# EAGLE schematic wuBaseV1.4PH (EAGLE 9.6.2)
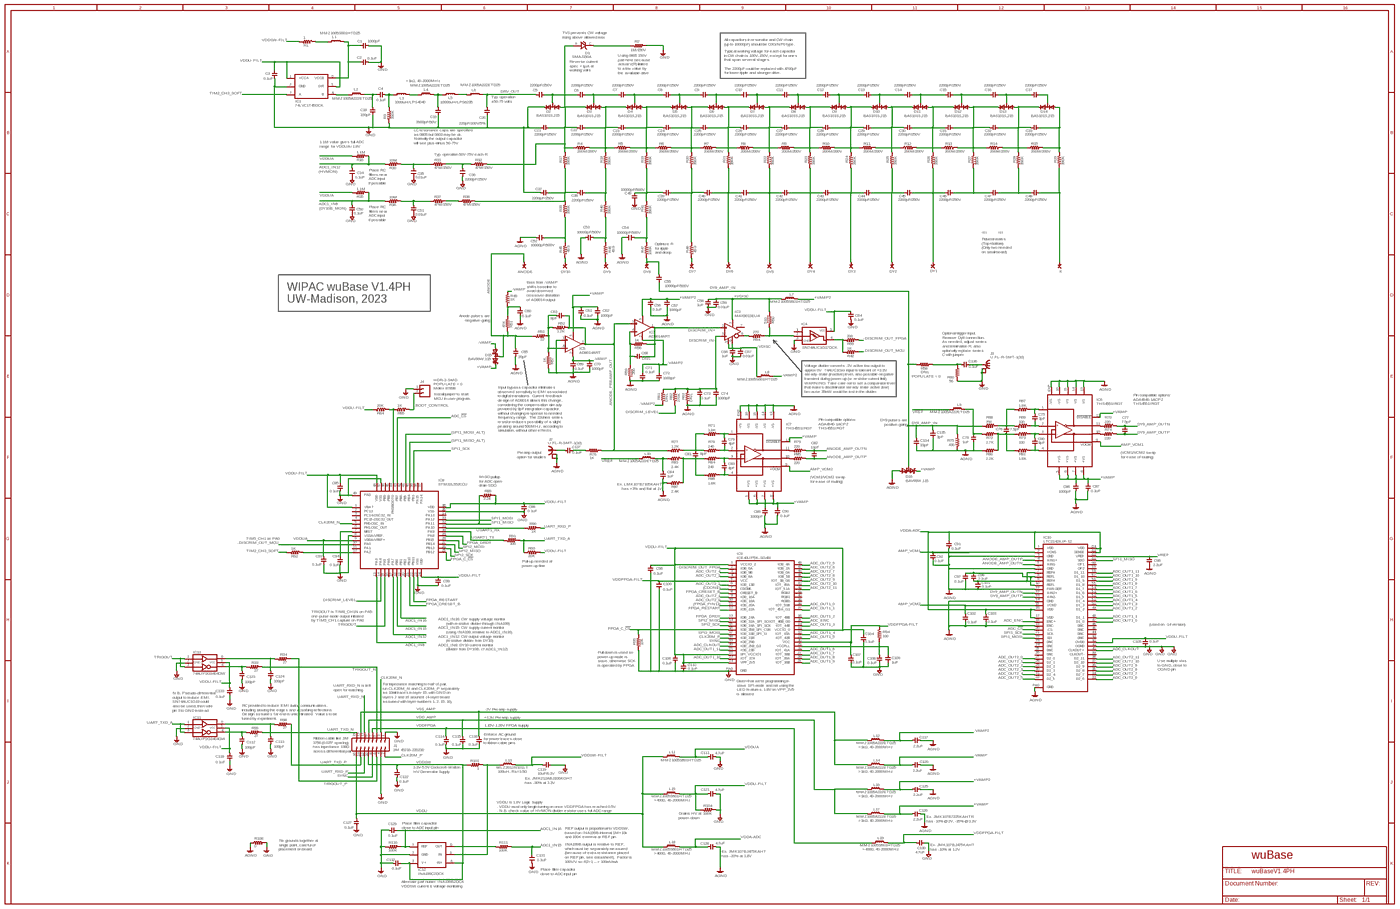
[diagram p0: schematic, sheet 1, overview]
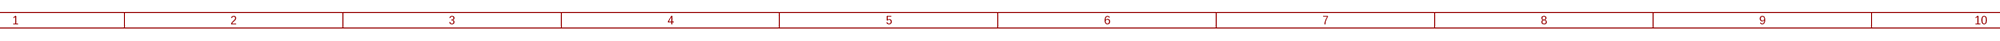
[diagram p1: schematic, sheet 1, part 1 of 4]
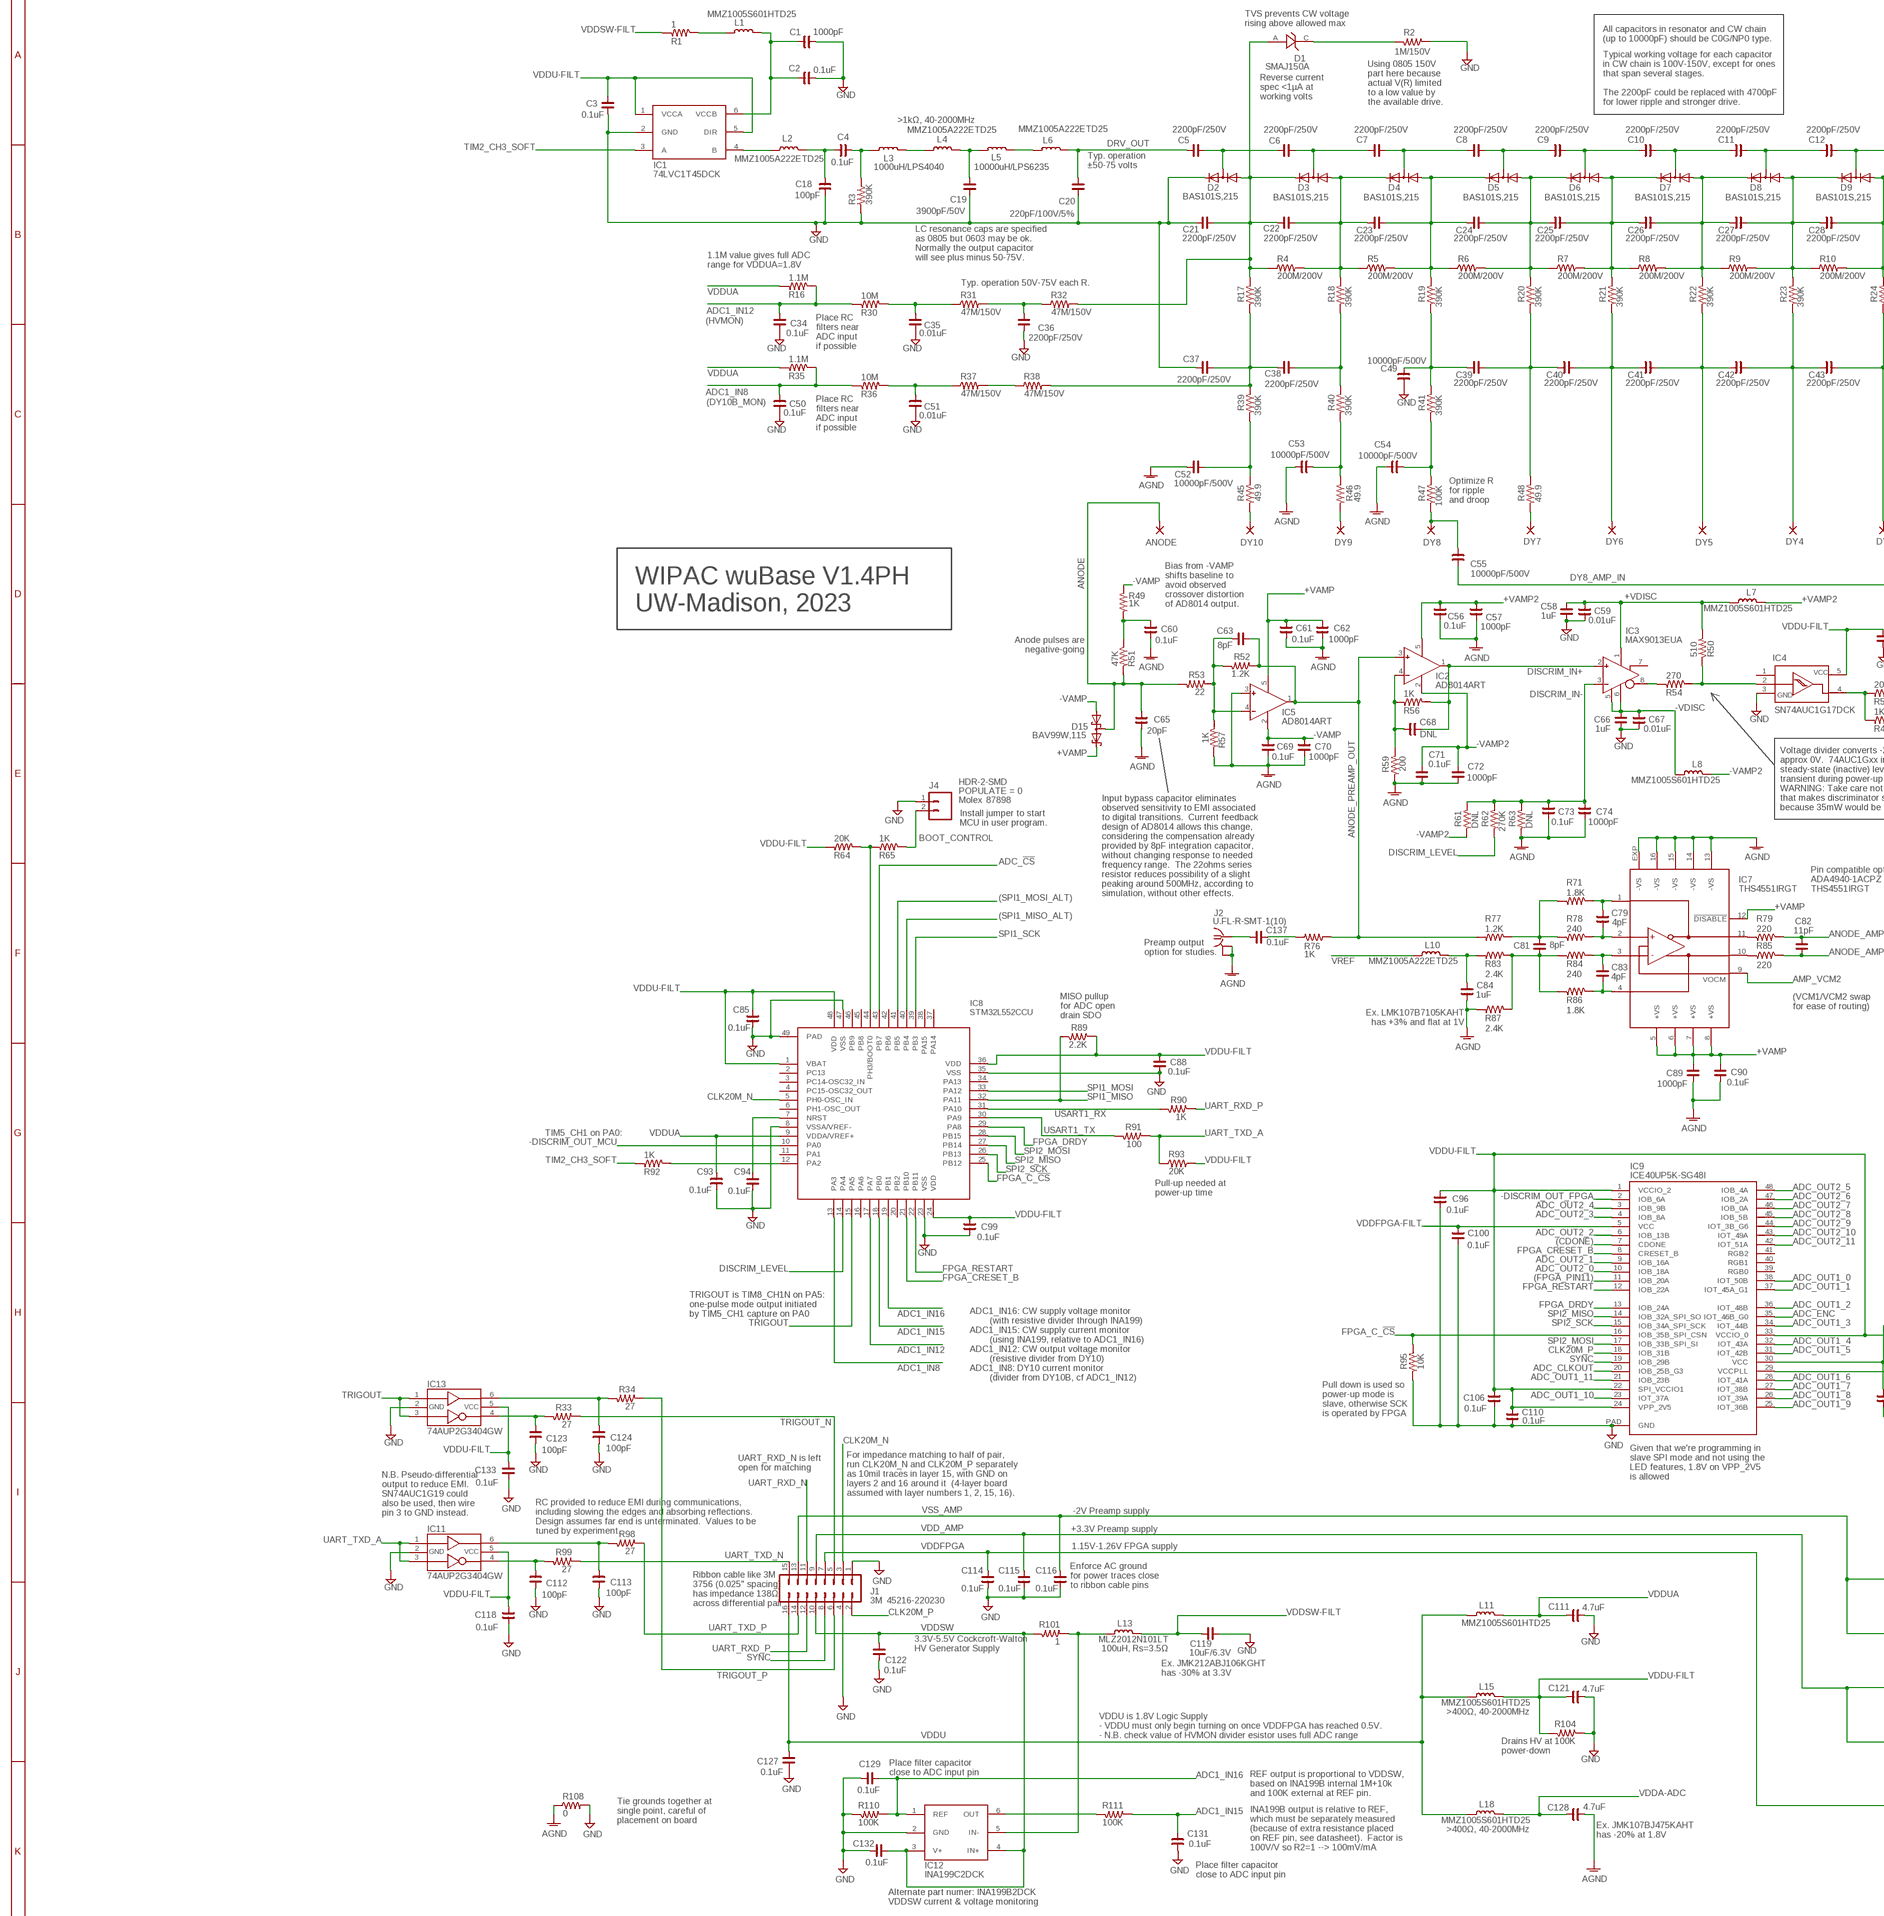
[diagram p2: schematic, sheet 1, part 2 of 4]
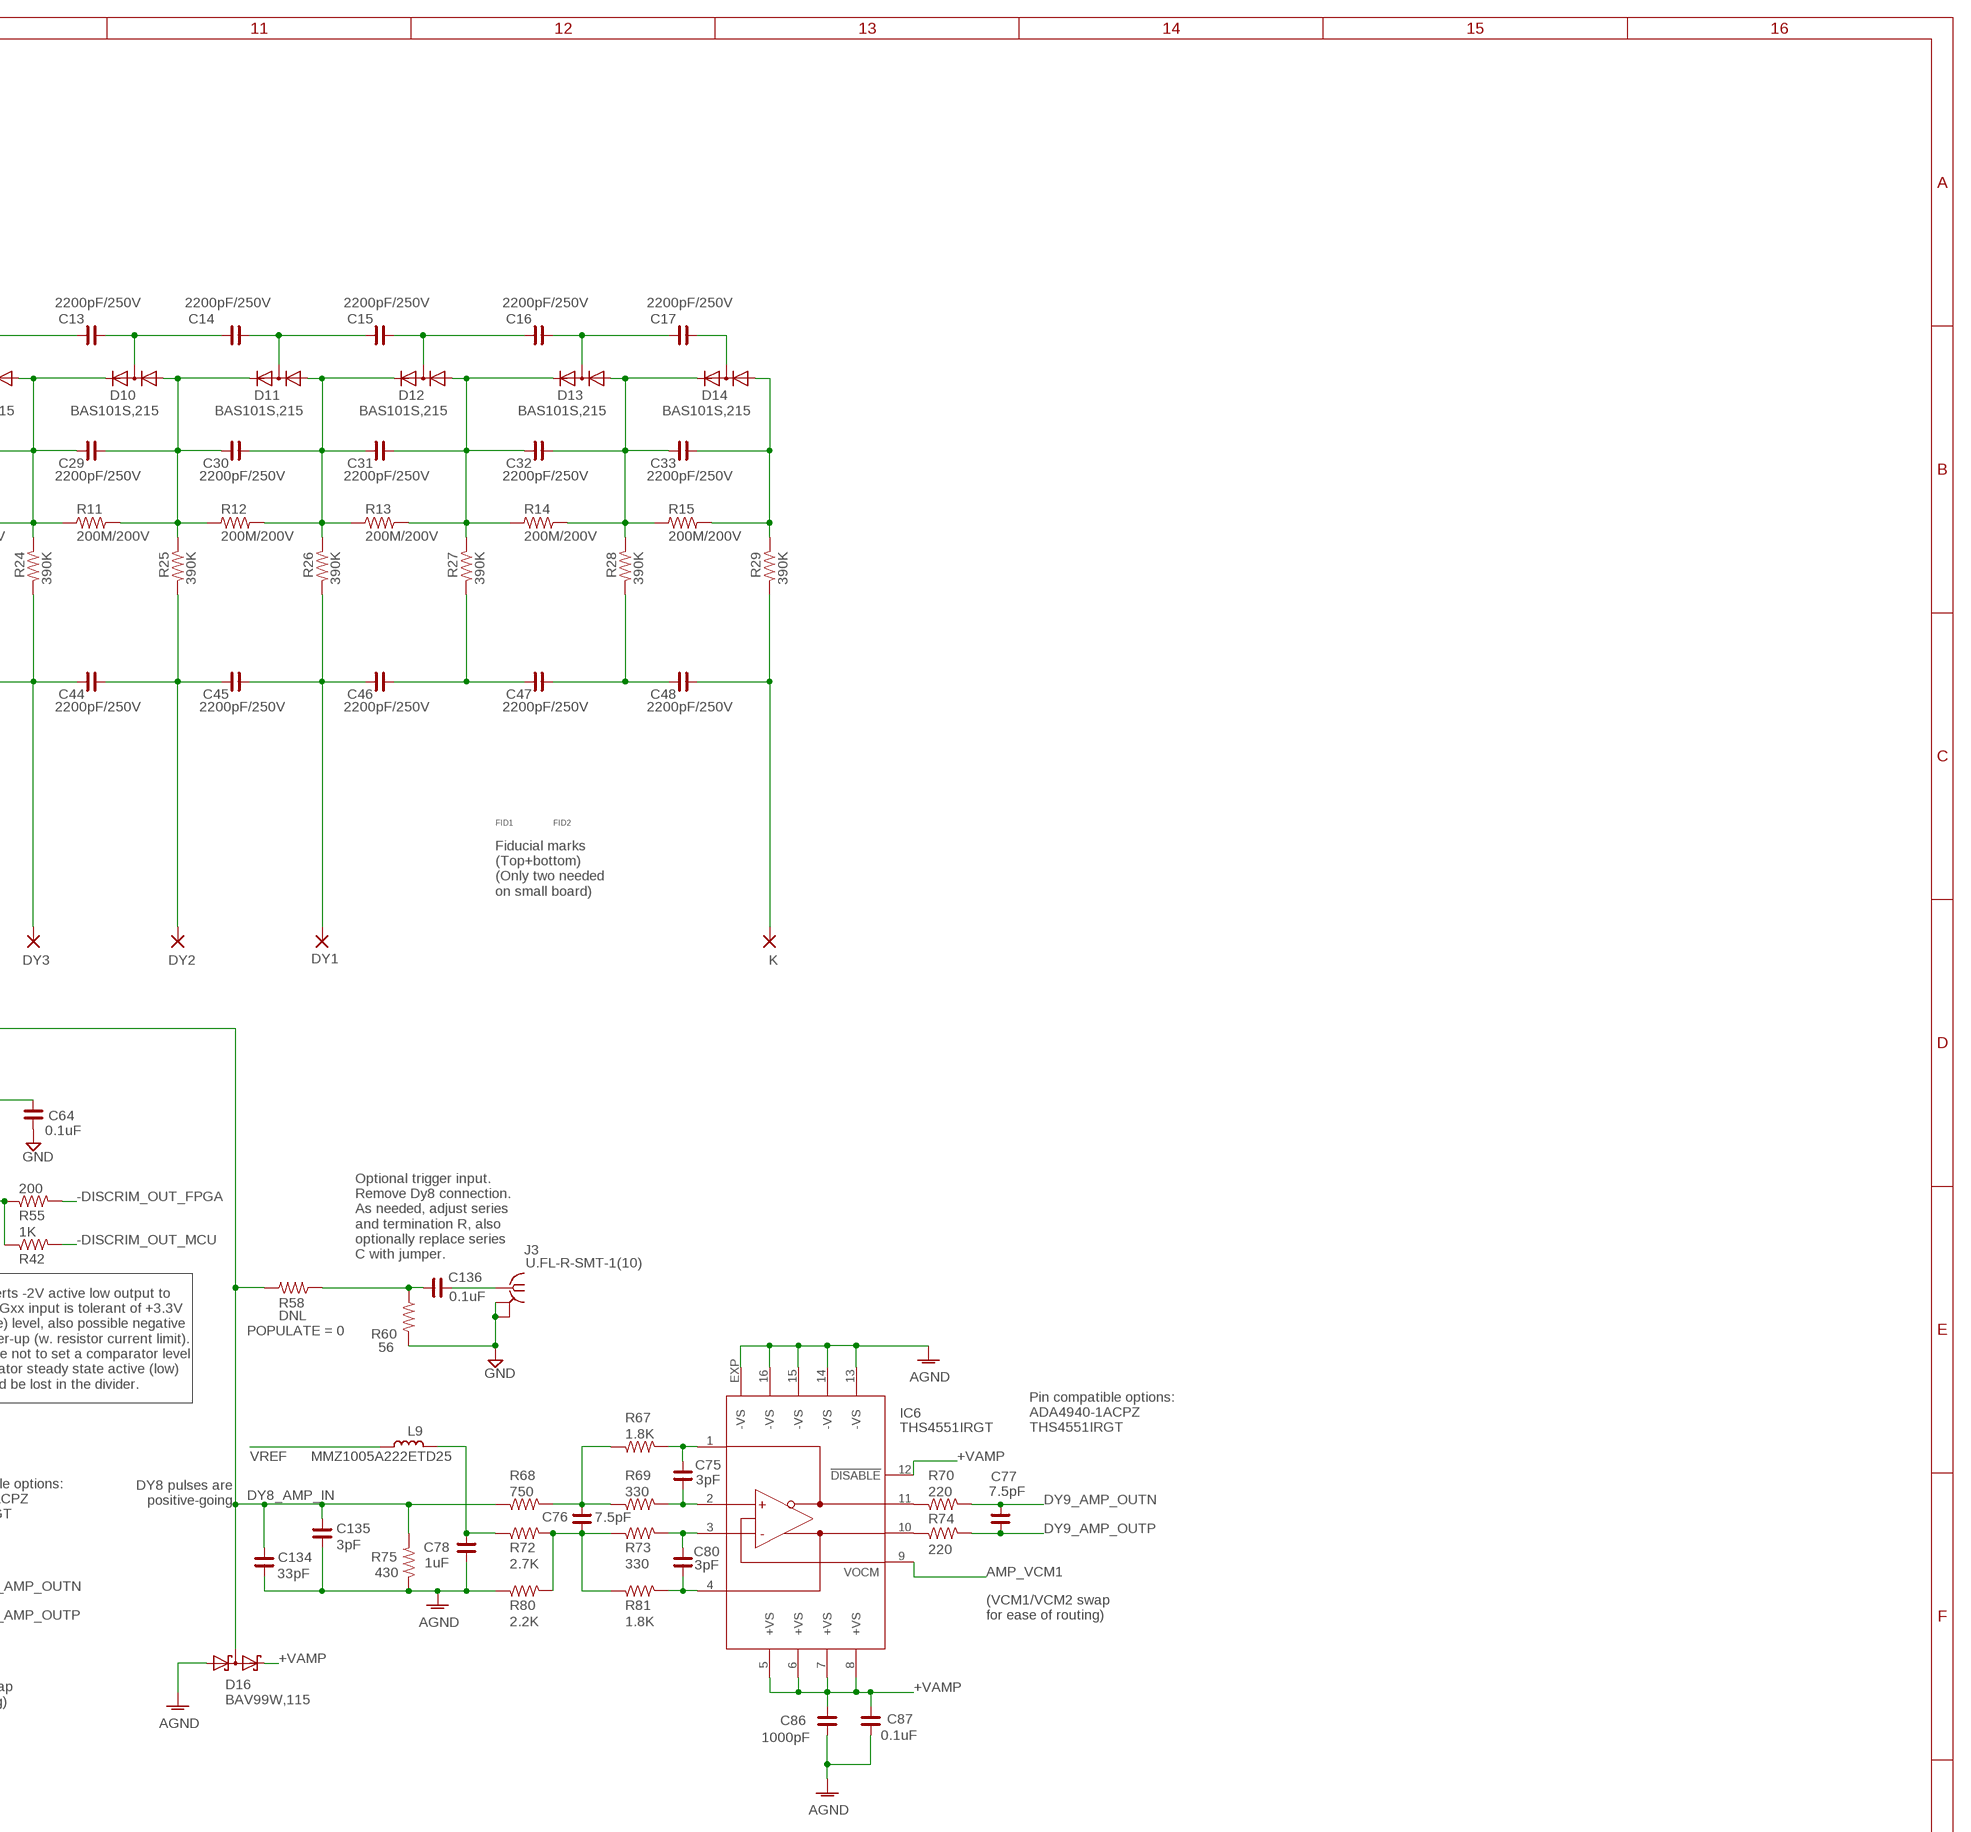
[diagram p3: schematic, sheet 1, part 3 of 4]
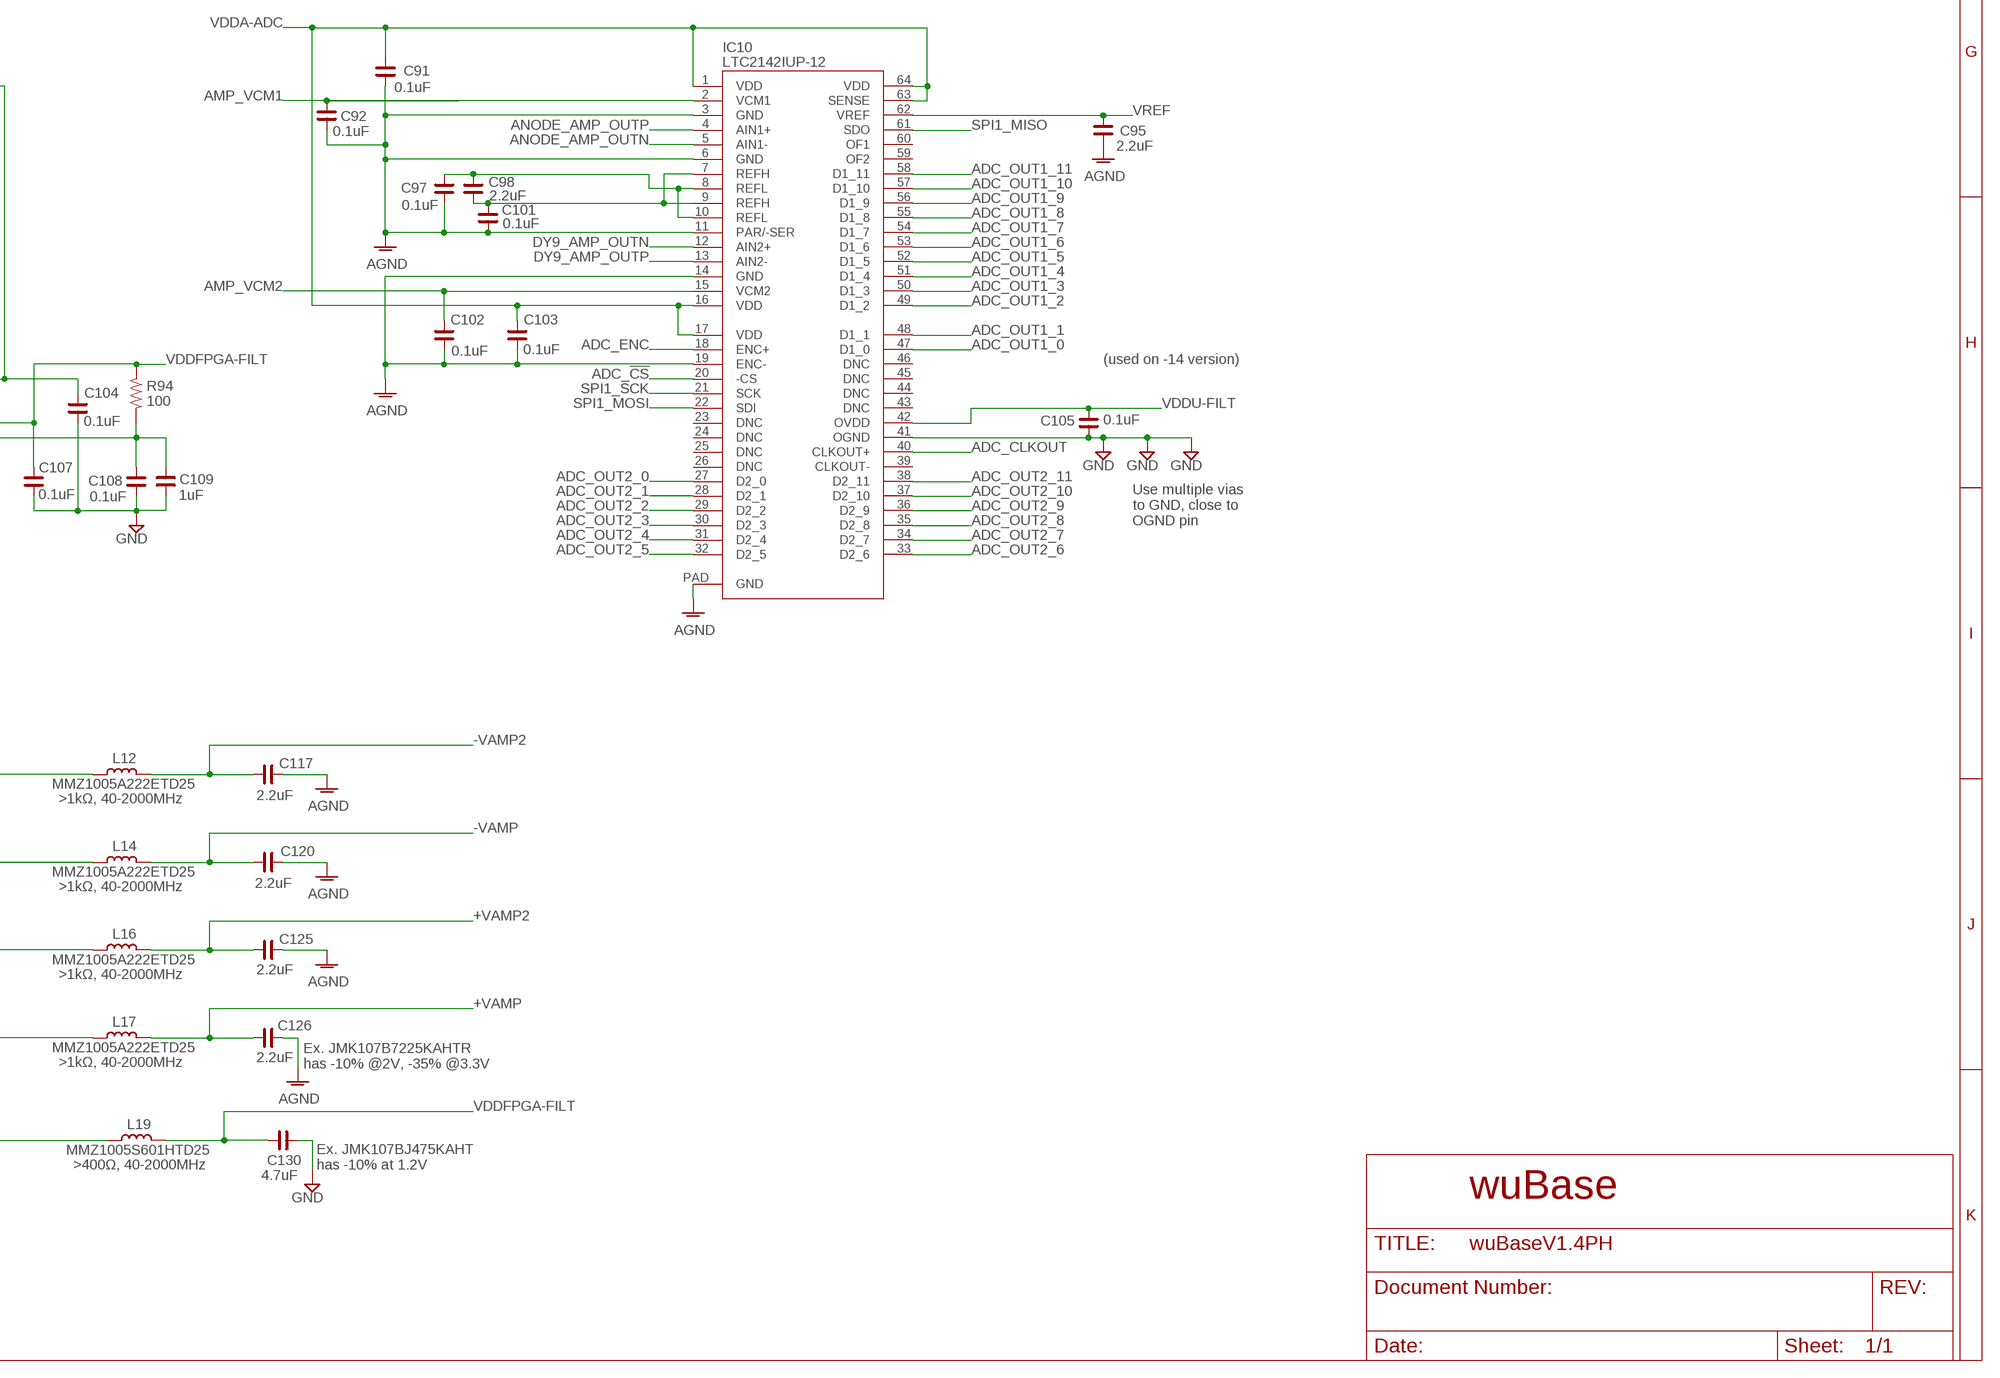
[diagram p4: schematic, sheet 1, part 4 of 4]

## Parts
ANODE  PAD-0430-BARE  [0430-BARE]
C1  1000pF  C_0402  [C0402]
C2  0.1uF  C_0402  [C0402]
C3  0.1uF  C_0402  [C0402]
C4  0.1uF  C_0402HV  [C0402-HV]
C5  2200pF/250V  C_0805HV  [C0805-HV]
C6  2200pF/250V  C_0805HV  [C0805-HV]
C7  2200pF/250V  C_0805HV  [C0805-HV]
C8  2200pF/250V  C_0805HV  [C0805-HV]
C9  2200pF/250V  C_0805HV  [C0805-HV]
C10  2200pF/250V  C_0805HV  [C0805-HV]
C11  2200pF/250V  C_0805HV  [C0805-HV]
C12  2200pF/250V  C_0805HV  [C0805-HV]
C13  2200pF/250V  C_0805HV  [C0805-HV]
C14  2200pF/250V  C_0805HV  [C0805-HV]
C15  2200pF/250V  C_0805HV  [C0805-HV]
C16  2200pF/250V  C_0805HV  [C0805-HV]
C17  2200pF/250V  C_0805HV  [C0805-HV]
C18  100pF  C_0402HV  [C0402-HV]
C19  3900pF/50V  C_0805HV  [C0805-HV]
C20  220pF/100V/5%  C_0805HV  [C0805-HV]
C21  2200pF/250V  C_0805HV  [C0805-HV]
C22  2200pF/250V  C_0805HV  [C0805-HV]
C23  2200pF/250V  C_0805HV  [C0805-HV]
C24  2200pF/250V  C_0805HV  [C0805-HV]
C25  2200pF/250V  C_0805HV  [C0805-HV]
C26  2200pF/250V  C_0805HV  [C0805-HV]
C27  2200pF/250V  C_0805HV  [C0805-HV]
C28  2200pF/250V  C_0805HV  [C0805-HV]
C29  2200pF/250V  C_0805HV  [C0805-HV]
C30  2200pF/250V  C_0805HV  [C0805-HV]
C31  2200pF/250V  C_0805HV  [C0805-HV]
C32  2200pF/250V  C_0805HV  [C0805-HV]
C33  2200pF/250V  C_0805HV  [C0805-HV]
C34  0.1uF  C_0402  [C0402]
C35  0.01uF  C_0402  [C0402]
C36  2200pF/250V  C_0805HV  [C0805-HV]
C37  2200pF/250V  C_0805HV  [C0805-HV]
C38  2200pF/250V  C_0805HV  [C0805-HV]
C39  2200pF/250V  C_0805HV  [C0805-HV]
C40  2200pF/250V  C_0805HV  [C0805-HV]
C41  2200pF/250V  C_0805HV  [C0805-HV]
C42  2200pF/250V  C_0805HV  [C0805-HV]
C43  2200pF/250V  C_0805HV  [C0805-HV]
C44  2200pF/250V  C_0805HV  [C0805-HV]
C45  2200pF/250V  C_0805HV  [C0805-HV]
C46  2200pF/250V  C_0805HV  [C0805-HV]
C47  2200pF/250V  C_0805HV  [C0805-HV]
C48  2200pF/250V  C_0805HV  [C0805-HV]
C49  10000pF/500V  C_1206HV  [C1206-HV]
C50  0.1uF  C_0402  [C0402]
C51  0.01uF  C_0402  [C0402]
C52  10000pF/500V  C_1206HV  [C1206-HV]
C53  10000pF/500V  C_1206HV  [C1206-HV]
C54  10000pF/500V  C_1206HV  [C1206-HV]
C55  10000pF/500V  C_1206HV  [C1206-HV]
C56  0.1uF  C_0402  [C0402]
C57  1000pF  C_0402  [C0402]
C58  1uF  C_0603  [C0603]
C59  0.01uF  C_0402  [C0402]
C60  0.1uF  C_0402  [C0402]
C61  0.1uF  C_0402  [C0402]
C62  1000pF  C_0402  [C0402]
C63  8pF  C_0402  [C0402]
C64  0.1uF  C_0402  [C0402]
C65  20pF  C_0402  [C0402]
C66  1uF  C_0603  [C0603]
C67  0.01uF  C_0402  [C0402]
C68  DNL  C_0402  [C0402]
C69  0.1uF  C_0402  [C0402]
C70  1000pF  C_0402  [C0402]
C71  0.1uF  C_0402  [C0402]
C72  1000pF  C_0402  [C0402]
C73  0.1uF  C_0402  [C0402]
C74  1000pF  C_0402  [C0402]
C75  3pF  C_0402  [C0402]
C76  7.5pF  C_0402  [C0402]
C77  7.5pF  C_0402  [C0402]
C78  1uF  C_0603  [C0603]
C79  4pF  C_0402  [C0402]
C80  3pF  C_0402  [C0402]
C81  8pF  C_0402  [C0402]
C82  11pF  C_0402  [C0402]
C83  4pF  C_0402  [C0402]
C84  1uF  C_0603  [C0603]
C85  0.1uF  C_0402  [C0402]
C86  1000pF  C_0402  [C0402]
C87  0.1uF  C_0402  [C0402]
C88  0.1uF  C_0402  [C0402]
C89  1000pF  C_0402  [C0402]
C90  0.1uF  C_0402  [C0402]
C91  0.1uF  C_0402  [C0402]
C92  0.1uF  C_0402  [C0402]
C93  0.1uF  C_0402  [C0402]
C94  0.1uF  C_0402  [C0402]
C95  2.2uF  C_0603  [C0603]
C96  0.1uF  C_0402  [C0402]
C97  0.1uF  C_0402  [C0402]
C98  2.2uF  C_0603  [C0603]
C99  0.1uF  C_0402  [C0402]
C100  0.1uF  C_0402  [C0402]
C101  0.1uF  C_0402  [C0402]
C102  0.1uF  C_0402  [C0402]
C103  0.1uF  C_0402  [C0402]
C104  0.1uF  C_0402  [C0402]
C105  0.1uF  C_0402  [C0402]
C106  0.1uF  C_0402  [C0402]
C107  0.1uF  C_0402  [C0402]
C108  0.1uF  C_0402  [C0402]
C109  1uF  C_0603  [C0603]
C110  0.1uF  C_0402  [C0402]
C111  4.7uF  C_0603  [C0603]
C112  100pF  C_0402  [C0402]
C113  100pF  C_0402  [C0402]
C114  0.1uF  C_0402  [C0402]
C115  0.1uF  C_0402  [C0402]
C116  0.1uF  C_0402  [C0402]
C117  2.2uF  C_0603  [C0603]
C118  0.1uF  C_0402  [C0402]
C119  10uF/6.3V  C_0805  [C0805]
C120  2.2uF  C_0603  [C0603]
C121  4.7uF  C_0603  [C0603]
C122  0.1uF  C_0402  [C0402]
C123  100pF  C_0402  [C0402]
C124  100pF  C_0402  [C0402]
C125  2.2uF  C_0603  [C0603]
C126  2.2uF  C_0603  [C0603]
C127  0.1uF  C_0402  [C0402]
C128  4.7uF  C_0603  [C0603]
C129  0.1uF  C_0402  [C0402]
C130  4.7uF  C_0603  [C0603]
C131  0.1uF  C_0402  [C0402]
C132  0.1uF  C_0402  [C0402]
C133  0.1uF  C_0402  [C0402]
C134  33pF  C_0402  [C0402]
C135  3pF  C_0402  [C0402]
C136  0.1uF  C_0402  [C0402]
C137  0.1uF  C_0402  [C0402]
D1  SMAJ150A  SMAJXXXA-HV  [DO214AC-HV]
D2  BAS101S,215  MMBD3004S-ROUNDED  [SOT23-ROUNDED]
D3  BAS101S,215  MMBD3004S-ROUNDED  [SOT23-ROUNDED]
D4  BAS101S,215  MMBD3004S-ROUNDED  [SOT23-ROUNDED]
D5  BAS101S,215  MMBD3004S-ROUNDED  [SOT23-ROUNDED]
D6  BAS101S,215  MMBD3004S-ROUNDED  [SOT23-ROUNDED]
D7  BAS101S,215  MMBD3004S-ROUNDED  [SOT23-ROUNDED]
D8  BAS101S,215  MMBD3004S-ROUNDED  [SOT23-ROUNDED]
D9  BAS101S,215  MMBD3004S-ROUNDED  [SOT23-ROUNDED]
D10  BAS101S,215  MMBD3004S-ROUNDED  [SOT23-ROUNDED]
D11  BAS101S,215  MMBD3004S-ROUNDED  [SOT23-ROUNDED]
D12  BAS101S,215  MMBD3004S-ROUNDED  [SOT23-ROUNDED]
D13  BAS101S,215  MMBD3004S-ROUNDED  [SOT23-ROUNDED]
D14  BAS101S,215  MMBD3004S-ROUNDED  [SOT23-ROUNDED]
D15  BAV99W,115  BAV99W  [SC70-3L]
D16  BAV99W,115  BAV99W  [SC70-3L]
DY1  PAD-0430-BARE  [0430-BARE]
DY2  PAD-0430-BARE  [0430-BARE]
DY3  PAD-0430-BARE  [0430-BARE]
DY4  PAD-0430-BARE  [0430-BARE]
DY5  PAD-0430-BARE  [0430-BARE]
DY6  PAD-0430-BARE  [0430-BARE]
DY7  PAD-0430-BARE  [0430-BARE]
DY8  PAD-0430-BARE  [0430-BARE]
DY9  PAD-0430-BARE  [0430-BARE]
DY10  PAD-0430-BARE  [0430-BARE]
FID1  FIDUCIAL_0.5MM  [FIDUCIAL_0.5MM]
FID2  FIDUCIAL_0.5MM  [FIDUCIAL_0.5MM]
IC1  74LVC1T45DCK  [SC70-6L-TI]
IC2  AD8014ART  [SOT23-5]
IC3  MAX9013EUA  [MSOP8]
IC4  SN74AUC1G17DCK  [SC70-5L-TI]
IC5  AD8014ART  [SOT23-5]
IC6  THS4551IRGT  ADA4940-1ACPZ  [LFCSP16]
IC7  THS4551IRGT  ADA4940-1ACPZ  [LFCSP16]
IC8  STM32L552CCU  [UFQFPN48-STMICRO]
IC9  ICE40UP5K-SG48I  [QFN48-ICE40ULTRA]
IC10  LTC2142IUP-12  LTC2141-12UP  [QFN64-LTC214X]
IC11  74AUP2G3404GW  [SC70-6L-TI]
IC12  INA199C2DCK  INA199B2DCK  [SC70-6L-TI]
IC13  74AUP2G3404GW  [SC70-6L-TI]
J1  HDR-16  HDR-2X8-3M-45216-220230  [3M-45216-220230]
J2  COAX-2GNDU.FL  [HIROSE_U.FL-R-SMT-1]
J3  COAX-2GNDU.FL  [HIROSE_U.FL-R-SMT-1]
J4  HDR-2-SMD  [HEADER-SMD-2X1-MINIMUM]
K  PAD-0430-BARE  [0430-BARE]
L1  MMZ1005S601HTD25  L_0402  [L0402]
L2  MMZ1005A222ETD25  L_0402HV  [L0402-HV]
L3  1000uH/LPS4040  L_LPS4040-REDUCED  [LPS4040-REDUCED]
L4  MMZ1005A222ETD25  L_0402HV  [L0402-HV]
L5  10000uH/LPS6235  L_LPS6235-REDUCED  [LPS6235-REDUCED]
L6  MMZ1005A222ETD25  L_0402HV  [L0402-HV]
L7  MMZ1005S601HTD25  L_0402  [L0402]
L8  MMZ1005S601HTD25  L_0402  [L0402]
L9  MMZ1005A222ETD25  L_0402  [L0402]
L10  MMZ1005A222ETD25  L_0402  [L0402]
L11  MMZ1005S601HTD25  L_0402  [L0402]
L12  MMZ1005A222ETD25  L_0402  [L0402]
L13  MLZ2012N101LT  L_0805  [L0805]
L14  MMZ1005A222ETD25  L_0402  [L0402]
L15  MMZ1005S601HTD25  L_0402  [L0402]
L16  MMZ1005A222ETD25  L_0402  [L0402]
L17  MMZ1005A222ETD25  L_0402  [L0402]
L18  MMZ1005S601HTD25  L_0402  [L0402]
L19  MMZ1005S601HTD25  L_0402  [L0402]
R1  1  R_0402  [R0402]
R2  1M/150V  R_0805HV  [R0805-HV]
R3  390K  R_0402HV  [R0402-HV]
R4  200M/200V  R_1206HV  [R1206-HV]
R5  200M/200V  R_1206HV  [R1206-HV]
R6  200M/200V  R_1206HV  [R1206-HV]
R7  200M/200V  R_1206HV  [R1206-HV]
R8  200M/200V  R_1206HV  [R1206-HV]
R9  200M/200V  R_1206HV  [R1206-HV]
R10  200M/200V  R_1206HV  [R1206-HV]
R11  200M/200V  R_1206HV  [R1206-HV]
R12  200M/200V  R_1206HV  [R1206-HV]
R13  200M/200V  R_1206HV  [R1206-HV]
R14  200M/200V  R_1206HV  [R1206-HV]
R15  200M/200V  R_1206HV  [R1206-HV]
R16  1.1M  R_0402  [R0402]
R17  390K  R_0402HV  [R0402-HV]
R18  390K  R_0402HV  [R0402-HV]
R19  390K  R_0402HV  [R0402-HV]
R20  390K  R_0402HV  [R0402-HV]
R21  390K  R_0402HV  [R0402-HV]
R22  390K  R_0402HV  [R0402-HV]
R23  390K  R_0402HV  [R0402-HV]
R24  390K  R_0402HV  [R0402-HV]
R25  390K  R_0402HV  [R0402-HV]
R26  390K  R_0402HV  [R0402-HV]
R27  390K  R_0402HV  [R0402-HV]
R28  390K  R_0402HV  [R0402-HV]
R29  390K  R_0402HV  [R0402-HV]
R30  10M  R_0402  [R0402]
R31  47M/150V  R_0805HV  [R0805-HV]
R32  47M/150V  R_0805HV  [R0805-HV]
R33  27  R_0402  [R0402]
R34  27  R_0402  [R0402]
R35  1.1M  R_0402  [R0402]
R36  10M  R_0402  [R0402]
R37  47M/150V  R_0805HV  [R0805-HV]
R38  47M/150V  R_0805HV  [R0805-HV]
R39  390K  R_0402HV  [R0402-HV]
R40  390K  R_0402HV  [R0402-HV]
R41  390K  R_0402HV  [R0402-HV]
R42  1K  R_0402  [R0402]
R45  49.9  R_0402HV  [R0402-HV]
R46  49.9  R_0402HV  [R0402-HV]
R47  100K  R_0402HV  [R0402-HV]
R48  49.9  R_0402HV  [R0402-HV]
R49  1K  R_0402  [R0402]
R50  510  R_0402  [R0402]
R51  47K  R_0402  [R0402]
R52  1.2K  R_0402  [R0402]
R53  22  R_0402  [R0402]
R54  270  R_0402  [R0402]
R55  200  R_0402  [R0402]
R56  1K  R_0402  [R0402]
R57  1K  R_0402  [R0402]
R58  DNL  R_0402  [R0402]
R59  200  R_0402  [R0402]
R60  56  R_0402  [R0402]
R61  DNL  R_0402  [R0402]
R62  270K  R_0402  [R0402]
R63  DNL  R_0402  [R0402]
R64  20K  R_0402  [R0402]
R65  1K  R_0402  [R0402]
R67  1.8K  R_0402  [R0402]
R68  750  R_0402  [R0402]
R69  330  R_0402  [R0402]
R70  220  R_0402  [R0402]
R71  1.8K  R_0402  [R0402]
R72  2.7K  R_0402  [R0402]
R73  330  R_0402  [R0402]
R74  220  R_0402  [R0402]
R75  430  R_0402  [R0402]
R76  1K  R_0402  [R0402]
R77  1.2K  R_0402  [R0402]
R78  240  R_0402  [R0402]
R79  220  R_0402  [R0402]
R80  2.2K  R_0402  [R0402]
R81  1.8K  R_0402  [R0402]
R83  2.4K  R_0402  [R0402]
R84  240  R_0402  [R0402]
R85  220  R_0402  [R0402]
R86  1.8K  R_0402  [R0402]
R87  2.4K  R_0402  [R0402]
R89  2.2K  R_0402  [R0402]
R90  1K  R_0402  [R0402]
R91  100  R_0402  [R0402]
R92  1K  R_0402  [R0402]
R93  20K  R_0402  [R0402]
R94  100  R_0402  [R0402]
R95  10K  R_0402  [R0402]
R98  27  R_0402  [R0402]
R99  27  R_0402  [R0402]
R101  1  R_0402  [R0402]
R104  100K  R_0402  [R0402]
R108  0  R_0402  [R0402]
R110  100K  R_0402  [R0402]
R111  100K  R_0402  [R0402]

## Nets
(CDONE): IC9.7(CDONE)
(FPGA_PIN11): IC9.11(IOB_20A)
(SPI1_MISO_ALT): IC8.40(PB4)
(SPI1_MOSI_ALT): IC8.41(PB5)
+VAMP: C61.1 C62.1 C86.1 C87.1 C89.1 C90.1 C126.2 D15.2(C2) D16.2(C2) IC5.5(V+) IC6.5(+VS) IC6.6(+VS) IC6.7(+VS) IC6.8(+VS) IC6.12(!DISABLE) IC7.5(+VS) IC7.6(+VS) IC7.7(+VS) IC7.8(+VS) IC7.12(!DISABLE) L17.2
+VAMP2: C56.1 C57.1 C125.2 IC2.5(V+) L7.2 L16.2
+VDISC: C58.1 C59.1 IC3.1(VCC) L7.1 R50.2
-DISCRIM_BUFOUT: IC4.4(OUT) R42.1 R55.1
-DISCRIM_OUT: IC3.8(QBAR) R54.1
-DISCRIM_OUT_DIVIDER: IC4.2(IN) R50.1 R54.2
-DISCRIM_OUT_FPGA: IC9.2(IOB_6A) R55.2
-DISCRIM_OUT_MCU: IC8.10(PA0) R42.2
-VAMP: C69.1 C70.1 C120.2 D15.1(A1) IC5.2(V-) L14.2 R49.1
-VAMP2: C71.1 C72.1 C117.2 IC2.2(V-) L8.2 L12.2 R61.2
-VDISC: C66.1 C67.1 IC3.5(LE) IC3.6(GND) L8.1
ADC1_IN8: C50.1 IC8.13(PA3) R35.2 R36.1
ADC1_IN12: C34.1 IC8.17(PA7) R16.2 R30.1
ADC1_IN15: C131.2 IC8.18(PB0) R111.1
ADC1_IN16: C129.2 IC8.19(PB1) IC12.1(REF) R110.1
ADC_!CS: IC8.43(PB7) IC10.20(-CS)
ADC_CLKOUT: IC9.20(IOB_25B_G3) IC10.40(CLKOUT+)
ADC_ENC: IC9.35(IOT_46B_G0) IC10.18(ENC+)
ADC_OUT1_0: IC9.38(IOT_50B) IC10.47(D1_0)
ADC_OUT1_1: IC9.37(IOT_45A_G1) IC10.48(D1_1)
ADC_OUT1_2: IC9.36(IOT_48B) IC10.49(D1_2)
ADC_OUT1_3: IC9.34(IOT_44B) IC10.50(D1_3)
ADC_OUT1_4: IC9.32(IOT_43A) IC10.51(D1_4)
ADC_OUT1_5: IC9.31(IOT_42B) IC10.52(D1_5)
ADC_OUT1_6: IC9.28(IOT_41A) IC10.53(D1_6)
ADC_OUT1_7: IC9.27(IOT_38B) IC10.54(D1_7)
ADC_OUT1_8: IC9.26(IOT_39A) IC10.55(D1_8)
ADC_OUT1_9: IC9.25(IOT_36B) IC10.56(D1_9)
ADC_OUT1_10: IC9.23(IOT_37A) IC10.57(D1_10)
ADC_OUT1_11: IC9.21(IOB_23B) IC10.58(D1_11)
ADC_OUT2_0: IC9.10(IOB_18A) IC10.27(D2_0)
ADC_OUT2_1: IC9.9(IOB_16A) IC10.28(D2_1)
ADC_OUT2_2: IC9.6(IOB_13B) IC10.29(D2_2)
ADC_OUT2_3: IC9.4(IOB_8A) IC10.30(D2_3)
ADC_OUT2_4: IC9.3(IOB_9B) IC10.31(D2_4)
ADC_OUT2_5: IC9.48(IOB_4A) IC10.32(D2_5)
ADC_OUT2_6: IC9.47(IOB_2A) IC10.33(D2_6)
ADC_OUT2_7: IC9.46(IOB_0A) IC10.34(D2_7)
ADC_OUT2_8: IC9.45(IOB_5B) IC10.35(D2_8)
ADC_OUT2_9: IC9.44(IOT_3B_G6) IC10.36(D2_9)
ADC_OUT2_10: IC9.43(IOT_49A) IC10.37(D2_10)
ADC_OUT2_11: IC9.42(IOT_51A) IC10.38(D2_11)
AGND: C52.1 C53.2 C54.2 C56.2 C57.2 C60.2 C61.2 C62.2 C65.2 C69.2 C70.2 C71.2 C72.2 C73.2 C74.2 C78.2 C84.2 C86.2 C87.2 C89.2 C90.2 C91.2 C92.2 C95.2 C97.2 C101.2 C102.2 C103.2 C117.1 C120.1 C125.1 C126.1 C128.1 C134.2 C135.2 D16.1(A1) IC5.3(IN+) IC6.13(-VS) IC6.14(-VS) IC6.15(-VS) IC6.16(-VS) IC6.EXP(-VS) IC7.13(-VS) IC7.14(-VS) IC7.15(-VS) IC7.16(-VS) IC7.EXP(-VS) IC10.3(GND) IC10.6(GND) IC10.11(PAR/-SER) IC10.14(GND) IC10.19(ENC-) IC10.PAD(GND) J2.2(GND) J2.3(GND) R57.2 R59.2 R63.2 R75.1 R80.1 R87.1 R108.1
AMP1_INM: C63.1 IC5.4(IN-) R52.2 R53.1 R57.1
AMP2_INM: C68.1 IC2.4(IN-) R56.1 R59.1
AMP_VCM1: C92.1 IC6.9(VOCM) IC10.2(VCM1)
AMP_VCM2: C102.1 IC7.9(VOCM) IC10.15(VCM2)
ANODE: ANODE.P$1(P) C65.1 D15.3(C1A2) R51.2 R53.2
ANODE_AMP_OUTN: C82.1 IC10.5(AIN1-) R79.2
ANODE_AMP_OUTP: C82.2 IC10.4(AIN1+) R85.2
ANODE_PREAMP_OUT: C63.2 IC2.3(IN+) IC5.1(OUT) R52.1 R76.1 R77.1
BIAS_FILT: C60.1 R49.2 R51.1
BOOT0: IC8.44(PH3/BOOT0) R64.2 R65.1
BOOT_CONTROL: J4.2 R65.2
CH1COAX: C137.1 J2.1(SIGNAL)
CH1COAX_DC: C137.2 R76.2
CH2COAX: C136.2 J3.1(SIGNAL)
CH2COAX_DC: C136.1 R58.1 R60.1
CLK20M_N: IC8.5(PH0-OSC_IN) J1.3
CLK20M_P: IC9.18(IOB_31B) J1.2
CW_1_KB: C15.2 C16.1 D12.3(C1A2)
CW_2_1: C14.2 C15.1 D11.3(C1A2)
CW_3_2: C13.2 C14.1 D10.3(C1A2)
CW_4_3: C12.2 C13.1 D9.3(C1A2)
CW_5_4: C11.2 C12.1 D8.3(C1A2)
CW_6_5: C10.2 C11.1 D7.3(C1A2)
CW_7_6: C9.2 C10.1 D6.3(C1A2)
CW_8_7: C8.2 C9.1 D5.3(C1A2)
CW_9_8: C7.2 C8.1 D4.3(C1A2)
CW_10_9: C6.2 C7.1 D3.3(C1A2)
CW_A_10: C5.2 C6.1 D2.3(C1A2)
CW_KA_K: C17.2 D14.3(C1A2)
CW_KB_KA: C16.2 C17.1 D13.3(C1A2)
DISCRIM_IN+: C68.2 IC2.1(OUT) IC3.2(IN+) R56.2
DISCRIM_IN-: C73.1 C74.1 IC3.3(IN-) R61.1 R62.1 R63.1
DISCRIM_LEVEL: IC8.14(PA4) R62.2
DRV_FILT: C4.2 C18.1 L2.2
DRV_L1INP: C4.1 L3.2 R3.2
DRV_L1OUT: L3.1 L4.1
DRV_L2INP: C19.1 L4.2 L5.2
DRV_L2OUT: L5.1 L6.2
DRV_OUT: C5.1 C20.1 L6.1
DRV_SQUARE: IC1.4(B) L2.1
DY1: C45.2 C46.1 DY1.P$1(P) R26.2
DY1A: C30.2 C31.1 D11.1(A1) D12.2(C2) R12.2 R13.1 R26.1
DY2: C44.2 C45.1 DY2.P$1(P) R25.2
DY2A: C29.2 C30.1 D10.1(A1) D11.2(C2) R11.2 R12.1 R25.1
DY3: C43.2 C44.1 DY3.P$1(P) R24.2
DY3A: C28.2 C29.1 D9.1(A1) D10.2(C2) R10.2 R11.1 R24.1
DY4: C42.2 C43.1 DY4.P$1(P) R23.2
DY4A: C27.2 C28.1 D8.1(A1) D9.2(C2) R9.2 R10.1 R23.1
DY5: C41.2 C42.1 DY5.P$1(P) R22.2
DY5A: C26.2 C27.1 D7.1(A1) D8.2(C2) R8.2 R9.1 R22.1
DY6: C40.2 C41.1 DY6.P$1(P) R21.2
DY6A: C25.2 C26.1 D6.1(A1) D7.2(C2) R7.2 R8.1 R21.1
DY7: DY7.P$1(P) R48.2
DY7A: C24.2 C25.1 D5.1(A1) D6.2(C2) R6.2 R7.1 R20.1
DY7B: C39.2 C40.1 R20.2 R48.1
DY8: C55.1 DY8.P$1(P) R47.2
DY8_AMP_IN: C55.2 C134.1 C135.1 D16.3(C1A2) R58.2 R68.1 R75.2
DY8A: C23.2 C24.1 D4.1(A1) D5.2(C2) R5.2 R6.1 R19.1
DY8B: C39.1 C49.1 R19.2 R41.1
DY8C: C54.1 R41.2 R47.1
DY9: DY9.P$1(P) R46.2
DY9_AMP_OUTN: C77.1 IC10.12(AIN2+) R70.2
DY9_AMP_OUTP: C77.2 IC10.13(AIN2-) R74.2
DY9A: C22.2 C23.1 D3.1(A1) D4.2(C2) R4.2 R5.1 R18.1
DY9B: C38.2 R18.2 R40.1
DY9C: C53.1 R40.2 R46.1
DY10: DY10.P$1(P) R45.2
DY10A: C21.2 C22.1 D1.A D2.1(A1) D3.2(C2) R4.1 R17.1 R32.2
DY10B: C37.2 C38.1 R17.2 R38.2 R39.1
DY10B_MON_A: R37.2 R38.1
DY10B_MON_B: C51.1 R36.2 R37.1
DY10C: C52.2 R39.2 R45.1
FPGA_C_!CS: IC8.25(PB12) IC9.16(IOB_35B_SPI_CSN) R95.1
FPGA_CRESET_B: IC8.21(PB10) IC9.8(CRESET_B)
FPGA_DRDY: IC8.29(PA8) IC9.13(IOB_24A)
FPGA_RESTART: IC8.22(PB11) IC9.12(IOB_22A)
GND: C1.1 C2.1 C3.1 C18.2 C19.2 C20.2 C21.1 C34.2 C35.2 C36.2 C37.1 C49.2 C50.2 C51.2 C58.2 C59.2 C64.1 C66.2 C67.2 C85.2 C88.2 C93.2 C94.2 C96.2 C99.2 C100.2 C104.2 C105.2 C106.2 C107.2 C108.2 C109.2 C110.2 C111.1 C112.2 C113.2 C114.2 C115.2 C116.2 C118.2 C119.2 C121.1 C122.2 C123.2 C124.2 C127.2 C129.1 C130.2 C131.1 C132.1 C133.2 D2.2(C2) IC1.2(GND) IC4.3(GND) IC8.8(VSSA/VREF-) IC8.23(VSS) IC8.35(VSS) IC8.47(VSS) IC8.49(PAD) IC9.PAD(GND) IC10.41(OGND) IC11.2(GND) IC12.2(GND) IC13.2(GND) J1.1 J1.4 J3.2(GND) J3.3(GND) J4.1 R2.1 R3.1 R60.2 R95.2 R104.1 R108.2 R110.2
HVMON_A: C36.1 R31.2 R32.1
HVMON_B: C35.1 R30.2 R31.1
K: C48.2 K.P$1(P) R29.2
K-DY1-AA: C32.2 C33.1 D13.1(A1) D14.2(C2) R14.2 R15.1 R28.1
K-DY1-AB: C47.2 C48.1 R28.2
K-DY1-BA: C31.2 C32.1 D12.1(A1) D13.2(C2) R13.2 R14.1 R27.1
K-DY1-BB: C46.2 C47.1 R27.2
KA: C33.2 D14.1(A1) R15.2 R29.1
N$11: C79.2 IC7.2(+IN) R78.2
N$15: C83.1 IC7.3(-IN) R84.2
N$16: C81.2 R83.2 R84.1 R86.1 R87.2
N$17: C81.1 R71.1 R77.2 R78.1
N$18: C79.1 IC7.1(-FB) R71.2
N$19: C83.2 IC7.4(+FB) R86.2
N$22: IC7.11(-OUT) R79.1
N$23: IC7.10(+OUT) R85.1
N$25: C75.2 IC6.2(+IN) R69.2
N$26: C80.1 IC6.3(-IN) R73.2
N$27: C76.1 R67.1 R68.2 R69.1
N$28: C76.2 R72.2 R73.1 R80.2 R81.1
N$29: C75.1 IC6.1(-FB) R67.2
N$30: C80.2 IC6.4(+FB) R81.2
N$33: IC6.11(-OUT) R70.1
N$34: IC6.10(+OUT) R74.1
NRST: C94.1 IC8.7(NRST)
REFH: C98.2 C101.1 IC10.7(REFH) IC10.9(REFH)
REFL: C97.1 C98.1 IC10.8(REFL) IC10.10(REFL)
SPI1_MISO: IC8.32(PA11) IC10.61(SDO) R89.2
SPI1_MOSI: IC8.33(PA12) IC10.22(SDI)
SPI1_SCK: IC8.39(PB3) IC10.21(SCK)
SPI2_MISO: IC8.27(PB14) IC9.14(IOB_32A_SPI_SO)
SPI2_MOSI: IC8.28(PB15) IC9.17(IOB_33B_SPI_SI)
SPI2_SCK: IC8.26(PB13) IC9.15(IOB_34A_SPI_SCK)
SYNC: IC9.19(IOB_29B) J1.8
TIM2_CH3: IC8.12(PA2) R92.2
TIM2_CH3_SOFT: IC1.3(A) R92.1
TRIGOUT: IC8.15(PA5) IC13.1(1A) IC13.3(2A)
TRIGOUT_N: J1.5 R33.1
TRIGOUT_NA: C123.1 IC13.4(2Y) R33.2
TRIGOUT_P: J1.6 R34.1
TRIGOUT_PA: C124.1 IC13.6(1Y) R34.2
TVS_OUT: D1.C R2.2
UART_RXD_N: J1.11
UART_RXD_P: J1.12 R90.1
UART_TXD_A: IC11.1(1A) IC11.3(2A) R91.1 R93.1
UART_TXD_N: J1.15 R99.1
UART_TXD_NA: C112.1 IC11.4(2Y) R99.2
UART_TXD_P: J1.14 R98.1
UART_TXD_PA: C113.1 IC11.6(1Y) R98.2
USART1_RX: IC8.31(PA10) R90.2
USART1_TX: IC8.30(PA9) R91.2
VCCPLL: C108.1 C109.1 IC9.29(VCCPLL) R94.2
VDD_AMP: C115.1 J1.9 L16.1 L17.1
VDDA-ADC: C91.1 C103.1 C128.2 IC10.1(VDD) IC10.16(VDD) IC10.17(VDD) IC10.63(SENSE) IC10.64(VDD) L18.2
VDDFPGA: C114.1 J1.7 L19.1
VDDFPGA-FILT: C100.1 C107.1 C130.1 IC9.5(VCC) IC9.30(VCC) L19.2 R94.1
VDDSW: C122.1 C132.2 IC12.3(V+) IC12.4(IN+) J1.10 R101.2
VDDSW-FILT: C119.1 L13.2 R1.1
VDDSW-FILT-RL: L1.2 R1.2
VDDSW-FINAL: C1.2 C2.2 IC1.6(VCCB) L1.1
VDDSW-RL: IC12.5(IN-) L13.1 R101.1
VDDSW_IMON: IC12.6(OUT) R111.2
VDDU: C127.1 J1.16 L11.1 L15.1 L18.1
VDDU-FILT: C3.2 C64.2 C85.1 C88.1 C96.1 C99.1 C104.1 C105.1 C106.1 C110.1 C118.1 C121.2 C133.1 IC1.1(VCCA) IC1.5(DIR) IC4.5(VCC) IC8.1(VBAT) IC8.24(VDD) IC8.36(VDD) IC8.48(VDD) IC9.1(VCCIO_2) IC9.22(SPI_VCCIO1) IC9.24(VPP_2V5) IC9.33(VCCIO_0) IC10.42(OVDD) IC11.5(VCC) IC13.5(VCC) L15.2 R64.1 R89.1 R93.2 R104.2
VDDUA: C93.1 C111.2 IC8.9(VDDA/VREF+) L11.2 R16.1 R35.1
VREF: C95.1 IC10.62(VREF) L9.1 L10.1
VREF_FILT1: C84.1 L10.2 R83.1
VREF_FILT2: C78.1 L9.2 R72.1
VSS_AMP: C116.1 J1.13 L12.1 L14.1
Unconnected: IC3.7(Q) IC4.1(NC) IC8.2(PC13) IC8.3(PC14-OSC32_IN) IC8.4(PC15-OSC32_OUT) IC8.6(PH1-OSC_OUT) IC8.11(PA1) IC8.16(PA6) IC8.20(PB2) IC8.34(PA13) IC8.37(PA14) IC8.38(PA15) IC8.42(PB6) IC8.45(PB8) IC8.46(PB9) IC9.39(RGB0) IC9.40(RGB1) IC9.41(RGB2) IC10.23(DNC) IC10.24(DNC) IC10.25(DNC) IC10.26(DNC) IC10.39(CLKOUT-) IC10.43(DNC) IC10.44(DNC) IC10.45(DNC) IC10.46(DNC) IC10.59(OF2) IC10.60(OF1)

## Notes on the sheet
- TVS prevents CW voltage
  rising above allowed max
- All capacitors in resonator and CW chain
  (up to 10000pF) should be C0G/NP0 type.
- Reverse current 
  spec <1µA at 
  working volts
- Using 0805 150V
  part here because
  actual V(R) limited
  to a low value by
  the available drive.
- Typical working voltage for each capacitor
  in CW chain is 100V-150V, except for ones
  that span several stages.
  
  The 2200pF could be replaced with 4700pF
  for lower ripple and stronger drive.
- >1kΩ, 40-2000MHz
- Typ. operation
  ±50-75 volts
- LC resonance caps are specified 
  as 0805 but 0603 may be ok.
  Normally the output capacitor 
  will see plus minus 50-75V.
- 1.1M value gives full ADC 
  range for VDDUA=1.8V
- Typ. operation 50V-75V each R.
- (HVMON)
- Place RC
  filters near
  ADC input
  if possible
- (DY10B_MON)
- Place RC
  filters near
  ADC input
  if possible
- Fiducial marks
  (Top+bottom)
  (Only two needed
  on small board)
- Optimize R
  for ripple
  and droop
- Bias from -VAMP
  shifts baseline to
  avoid observed
  crossover distortion 
  of AD8014 output.
- WIPAC wuBase V1.4PH
  UW-Madison, 2023
- Anode pulses are
  negative-going
- Optional trigger input.  
  Remove Dy8 connection.
  As needed, adjust series
  and termination R, also
  optionally replace series
  C with jumper.
- Voltage divider converts -2V active low output to 
  approx 0V.  74AUC1Gxx input is tolerant of +3.3V 
  steady-state (inactive) level, also possible negative 
  transient during power-up (w. resistor current limit).
  WARNING: Take care not to set a comparator level 
  that makes discriminator steady state active (low) 
  because 35mW would be lost in the divider.
- Install jumper to start 
  MCU in user program.
- Pin compatible options:
  ADA4940-1ACPZ
  THS4551IRGT
- DY8 pulses are
  positive-going
- Pin compatible options:
  ADA4940-1ACPZ
  THS4551IRGT
- Input bypass capacitor eliminates
  observed sensitivity to EMI associated
  to digital transitions.  Current feedback
  design of AD8014 allows this change,
  considering the compensation already
  provided by 8pF integration capacitor,
  without changing response to needed
  frequency range.  The 22ohms series
  resistor reduces possibility of a slight
  peaking around 500MHz, according to
  simulation, without other effects.
- Preamp output
  option for studies.
- (VCM1/VCM2 swap
  for ease of routing)
- Ex. LMK107B7105KAHT
  has +3% and flat at 1V
- (VCM1/VCM2 swap
  for ease of routing)
- MISO pullup
  for ADC open
  drain SDO
- TIM5_CH1 on PA0:
- Pull-up needed at
  power-up time
- ADC1_IN16: CW supply voltage monitor
          (with resistive divider through INA199)
  ADC1_IN15: CW supply current monitor 
          (using INA199, relative to ADC1_IN16)
  ADC1_IN12: CW output voltage monitor
          (resistive divider from DY10)
  ADC1_IN8: DY10 current monitor
          (divider from DY10B, cf ADC1_IN12)
- TRIGOUT is TIM8_CH1N on PA5:
  one-pulse mode output initiated
  by TIM5_CH1 capture on PA0
- (used on -14 version)
- Pull down is used so
  power-up mode is 
  slave, otherwise SCK
  is operated by FPGA
- Use multiple vias
  to GND, close to
  OGND pin
- UART_RXD_N is left
  open for matching
- Given that we're programming in
  slave SPI mode and not using the
  LED features, 1.8V on VPP_2V5
  is allowed
- For impedance matching to half of pair,
  run CLK20M_N and CLK20M_P separately
  as 10mil traces in layer 15, with GND on
  layers 2 and 16 around it  (4-layer board
  assumed with layer numbers 1, 2, 15, 16).
- -2V Preamp supply
- N.B. Pseudo-differential
  output to reduce EMI.
  SN74AUC1G19 could
  also be used, then wire
  pin 3 to GND instead.
- +3.3V Preamp supply
- RC provided to reduce EMI during communications,
  including slowing the edges and absorbing reflections.
  Design assumes far end is unterminated.  Values to be
  tuned by experiment.
- 1.15V-1.26V FPGA supply
- Enforce AC ground
  for power traces close
  to ribbon cable pins
- >1kΩ, 40-2000MHz
- Ribbon cable like 3M
  3756 (0.025" spacing)
  has impedance 138Ω 
  across differential pair
- 3.3V-5.5V Cockcroft-Walton
  HV Generator Supply
- 100uH, Rs=3.5Ω | >1kΩ, 40-2000MHz
- Ex. JMK212ABJ106KGHT
  has -30% at 3.3V
- >1kΩ, 40-2000MHz
- VDDU is 1.8V Logic Supply
  - VDDU must only begin turning on once VDDFPGA has reached 0.5V.
  - N.B. check value of HVMON divider esistor uses full ADC range
- >400Ω, 40-2000MHz
- Drains HV at
  power-down
- >1kΩ, 40-2000MHz
- Ex. JMK107B7225KAHTR
  has -10% @2V, -35% @3.3V
- Place filter capacitor
  close to ADC input pin
- REF output is proportional to VDDSW, 
  based on INA199B internal 1M+10k
  and 100K external at REF pin.
- Tie grounds together at 
  single point, careful of 
  placement on board
- >400Ω, 40-2000MHz
- Ex. JMK107BJ475KAHT
  has -10% at 1.2V
- >400Ω, 40-2000MHz
- Ex. JMK107BJ475KAHT
  has -20% at 1.8V
- wuBase
- INA199B output is relative to REF, 
  which must be separately measured 
  (because of extra resistance placed 
  on REF pin, see datasheet).  Factor is
  100V/V so R2=1 --> 100mV/mA
- Place filter capacitor
  close to ADC input pin
- Alternate part numer: INA199B2DCK
  VDDSW current & voltage monitoring

## Library data of the parts
ANODE DY1-DY10 K = chw:PAD: Wire or pin pad Standard US Drill Sizes, SMD pads, pin receptacles
C1 C57 C62 C70 C72 C74 C86 C89 = chw:C_: Capacitor; MPN: GCM155R71H102KA37D; POPULATE: 1
C2-C4 C34 C50 C56 C60 C61 C64 C69 C71 C73 C85 C87 C88 C90-C94 C96 C97 C99-C108 C110 C114-C116 C118 C122 C127 C129 C131-C133 C136 C137 = chw:C_: Capacitor; MPN: GCM155R71C104KA55D; POPULATE: 1
C5-C17 C21-C33 C36-C48 = chw:C_: Capacitor; MPN: C0805C222JAGACAUTO; POPULATE: 1
C18 C112 C113 C123 C124 = chw:C_: Capacitor; MPN: C0402C101J3GACAUTO; POPULATE: 1
C19 = chw:C_: Capacitor; MPN: CGA4C2C0G1H392J060AA; POPULATE: 1
C20 = chw:C_: Capacitor; MPN: C0805C221J1GACAUTO; POPULATE: 1
C35 C51 C59 C67 = chw:C_: Capacitor; MPN: CGA2B2X5R1E103K050BA; POPULATE: 1
C49 C52-C55 = chw:C_: Capacitor; MPN: CGA5L4NP02J103J160AA; POPULATE: 1
C58 C66 C78 C84 C109 = chw:C_: Capacitor; MPN: LMK107B7105KAHT; POPULATE: 1
C63 C81 = chw:C_: Capacitor; MPN: GCM1555C1H8R0BA16D; POPULATE: 1
C65 = chw:C_: Capacitor; MPN: GCM1555C1H200JA16D; POPULATE: 1
C68 = chw:C_: Capacitor; POPULATE: 0
C75 C80 C135 = chw:C_: Capacitor; MPN: GCM1555C1H3R0BA16D; POPULATE: 1
C76 C77 = chw:C_: Capacitor; MPN: GCQ1555C1H7R5BB01D; POPULATE: 1
C79 C83 = chw:C_: Capacitor; MPN: GCM1555C1H4R0BA16D; POPULATE: 1
C82 = chw:C_: Capacitor; MPN: GCM1555C1H110FA16D; POPULATE: 1
C95 C98 C117 C120 C125 C126 = chw:C_: Capacitor; MPN: CGA3E1X7R0J225K080AC; POPULATE: 1
C111 C121 C128 C130 = chw:C_: Capacitor; MPN: JMK107BJ475KAHT; POPULATE: 1
C119 = chw:C_: Capacitor; MPN: C0805C106K8PACTU; POPULATE: 1
C134 = chw:C_: Capacitor; MPN: GCM1555C1H330FA16D; POPULATE: 1
D1 = chw:SMAJ*A: TVS Diode, unidirectional; MPN: SMAJ150A
D2-D14 = chw:MMBD3004S; MPN: BAS101S,215; POPULATE: 1
D15 D16 = chw:BAV99: Dual Schottky Diodes; MPN: BAV99W,115; POPULATE: 1
FID1 FID2 = chw:FIDUCIAL: Library: MF_Aesthetics Description: Fiducial marking for PCB alignment inside PNP and other machines.; HOUSEPART: NO; POPULATE: 0
IC1 = chw:74*1T45: 74*1T45 Level Translator; MPN: 74LVC1T45GW-Q100H; POPULATE: 1
IC2 IC5 = chw:AD8014: AD8014 Op amp, 400MHz, 1.15mA, 3.5nV/sqrtHz; MPN: AD8014ARTZ-REEL7; POPULATE: 1
IC3 = chw:MAX9013: Comparator with differential output and latch enable; MPN: MAX9013EUA+; POPULATE: 1
IC4 = chw:SN74*1G17: Schmitt trigger buffer; MPN: SN74AUC1G17DCKR
IC6 IC7 = chw:ADA4940-1: Ultralow Power, Low Distortion Fully Differential ADC Driver; MPN: THS4551IRGTR; POPULATE: 1
IC8 = chw:STM32L552C: STM32L552 ARM Cortex-M33 MCU+FPU; MPN: STM32L552CCU6; POPULATE: 1
IC9 = chw:ICE40UP5K-SG48I: iCE40 Ultra FPGA SG48 version; MPN: ICE40UP5K-SG48I; POPULATE: 1
IC10 = chw:LTC2141-12; MPN: LTC2141IUP-12; POPULATE: 1
IC11 IC13 = chw:74*2G3404: Buffer plus inverter; MPN: 74AUP2G3404GW,125; POPULATE: 1
IC12 = chw:INA199: INA199 Low or High-Side Current Shunt Monitor; MPN: INA199C2DCKR; POPULATE: 1
J1 = chw:HDR-2X8; MFG: 3M; MPN: 45216-220230; POPULATE: 1
J2 J3 = chw:COAX-2GND; MPN: U.FL-R-SMT-1(10); POPULATE: 1
J4 = chw:HDR-2: Header or Screw Terminal Block; MFG: Molex; MPN: 87898; POPULATE: 0
L1 L7 L8 L11 L15 L18 L19 = chw:L_; MPN: MMZ1005S601ETD25; POPULATE: 1
L2 L4 L6 L9 L10 L12 L14 L16 L17 = chw:L_; MPN: MMZ1005A222ETD25; POPULATE: 1
L3 = chw:L_; MPN: LPS4040-105MRC; POPULATE: 1
L5 = chw:L_; MPN: LPS6235-106MRC; POPULATE: 1
L13 = chw:L_; MPN: MLZ2012N101LTD25; POPULATE: 1
R1 R101 = chw:R_: Resistor; MPN: AC0402FR-071RL; POPULATE: 1
R2 = chw:R_: Resistor; MPN: AC0805FR-071ML; POPULATE: 1
R3 R17-R29 R39-R41 = chw:R_: Resistor; MPN: AC0402FR-07390KL; POPULATE: 1
R4-R15 = chw:R_: Resistor; MPN: CRCW1206200MJPEAHR; POPULATE: 1
R16 R35 = chw:R_: Resistor; MPN: AC0402FR-071M1L; POPULATE: 1
R30 R36 = chw:R_: Resistor; MPN: AC0402FR-0710ML; POPULATE: 1
R31 R32 R37 R38 = chw:R_: Resistor; MPN: RC0805JR-0747ML; POPULATE: 1
R33 R34 R98 R99 = chw:R_: Resistor; MPN: AC0402FR-0727RL; POPULATE: 1
R42 R49 R56 R57 R65 R76 R90 R92 = chw:R_: Resistor; MPN: AC0402FR-071KL; POPULATE: 1
R45 R46 R48 = chw:R_: Resistor; MPN: AC0402FR-0749R9L; POPULATE: 1
R47 R104 R110 R111 = chw:R_: Resistor; MPN: AC0402FR-07100KL; POPULATE: 1
R50 = chw:R_: Resistor; MPN: AC0402FR-07510RL; POPULATE: 1
R51 = chw:R_: Resistor; MPN: AC0402FR-0747KL; POPULATE: 1
R52 R77 = chw:R_: Resistor; MPN: AC0402FR-071K2L; POPULATE: 1
R53 = chw:R_: Resistor; MPN: AC0402FR-0722RL; POPULATE: 1
R54 = chw:R_: Resistor; MPN: AC0402FR-07270RL; POPULATE: 1
R55 R59 = chw:R_: Resistor; MPN: AC0402FR-07200RL; POPULATE: 1
R58 R61 R63 = chw:R_: Resistor; POPULATE: 0
R60 = chw:R_: Resistor; MPN: AC0402FR-0756RL; POPULATE: 1
R62 = chw:R_: Resistor; MPN: AC0402FR-07270KL; POPULATE: 1
R64 R93 = chw:R_: Resistor; MPN: AC0402FR-0720KL; POPULATE: 1
R67 R71 R81 R86 = chw:R_: Resistor; MPN: AC0402FR-071K8L; POPULATE: 1
R68 = chw:R_: Resistor; MPN: AC0402FR-07750RL; POPULATE: 1
R69 R73 = chw:R_: Resistor; MPN: AC0402FR-07330RL; POPULATE: 1
R70 R74 R79 R85 = chw:R_: Resistor; MPN: AC0402FR-07220RL; POPULATE: 1
R72 = chw:R_: Resistor; MPN: AC0402FR-072K7L; POPULATE: 1
R75 = chw:R_: Resistor; MPN: AC0402FR-07430RL; POPULATE: 1
R78 R84 = chw:R_: Resistor; MPN: AC0402FR-07240RL; POPULATE: 1
R80 R89 = chw:R_: Resistor; MPN: AC0402FR-072K2L; POPULATE: 1
R83 R87 = chw:R_: Resistor; MPN: AC0402FR-072K4L; POPULATE: 1
R91 R94 = chw:R_: Resistor; MPN: AC0402FR-07100RL; POPULATE: 1
R95 = chw:R_: Resistor; MPN: AC0402FR-0710KL; POPULATE: 1
R108 = chw:R_: Resistor; MPN: RC0402JR-070RL; POPULATE: 1